# EAGLE design Color-lcd-backpack-v1 (EAGLE 5.06)
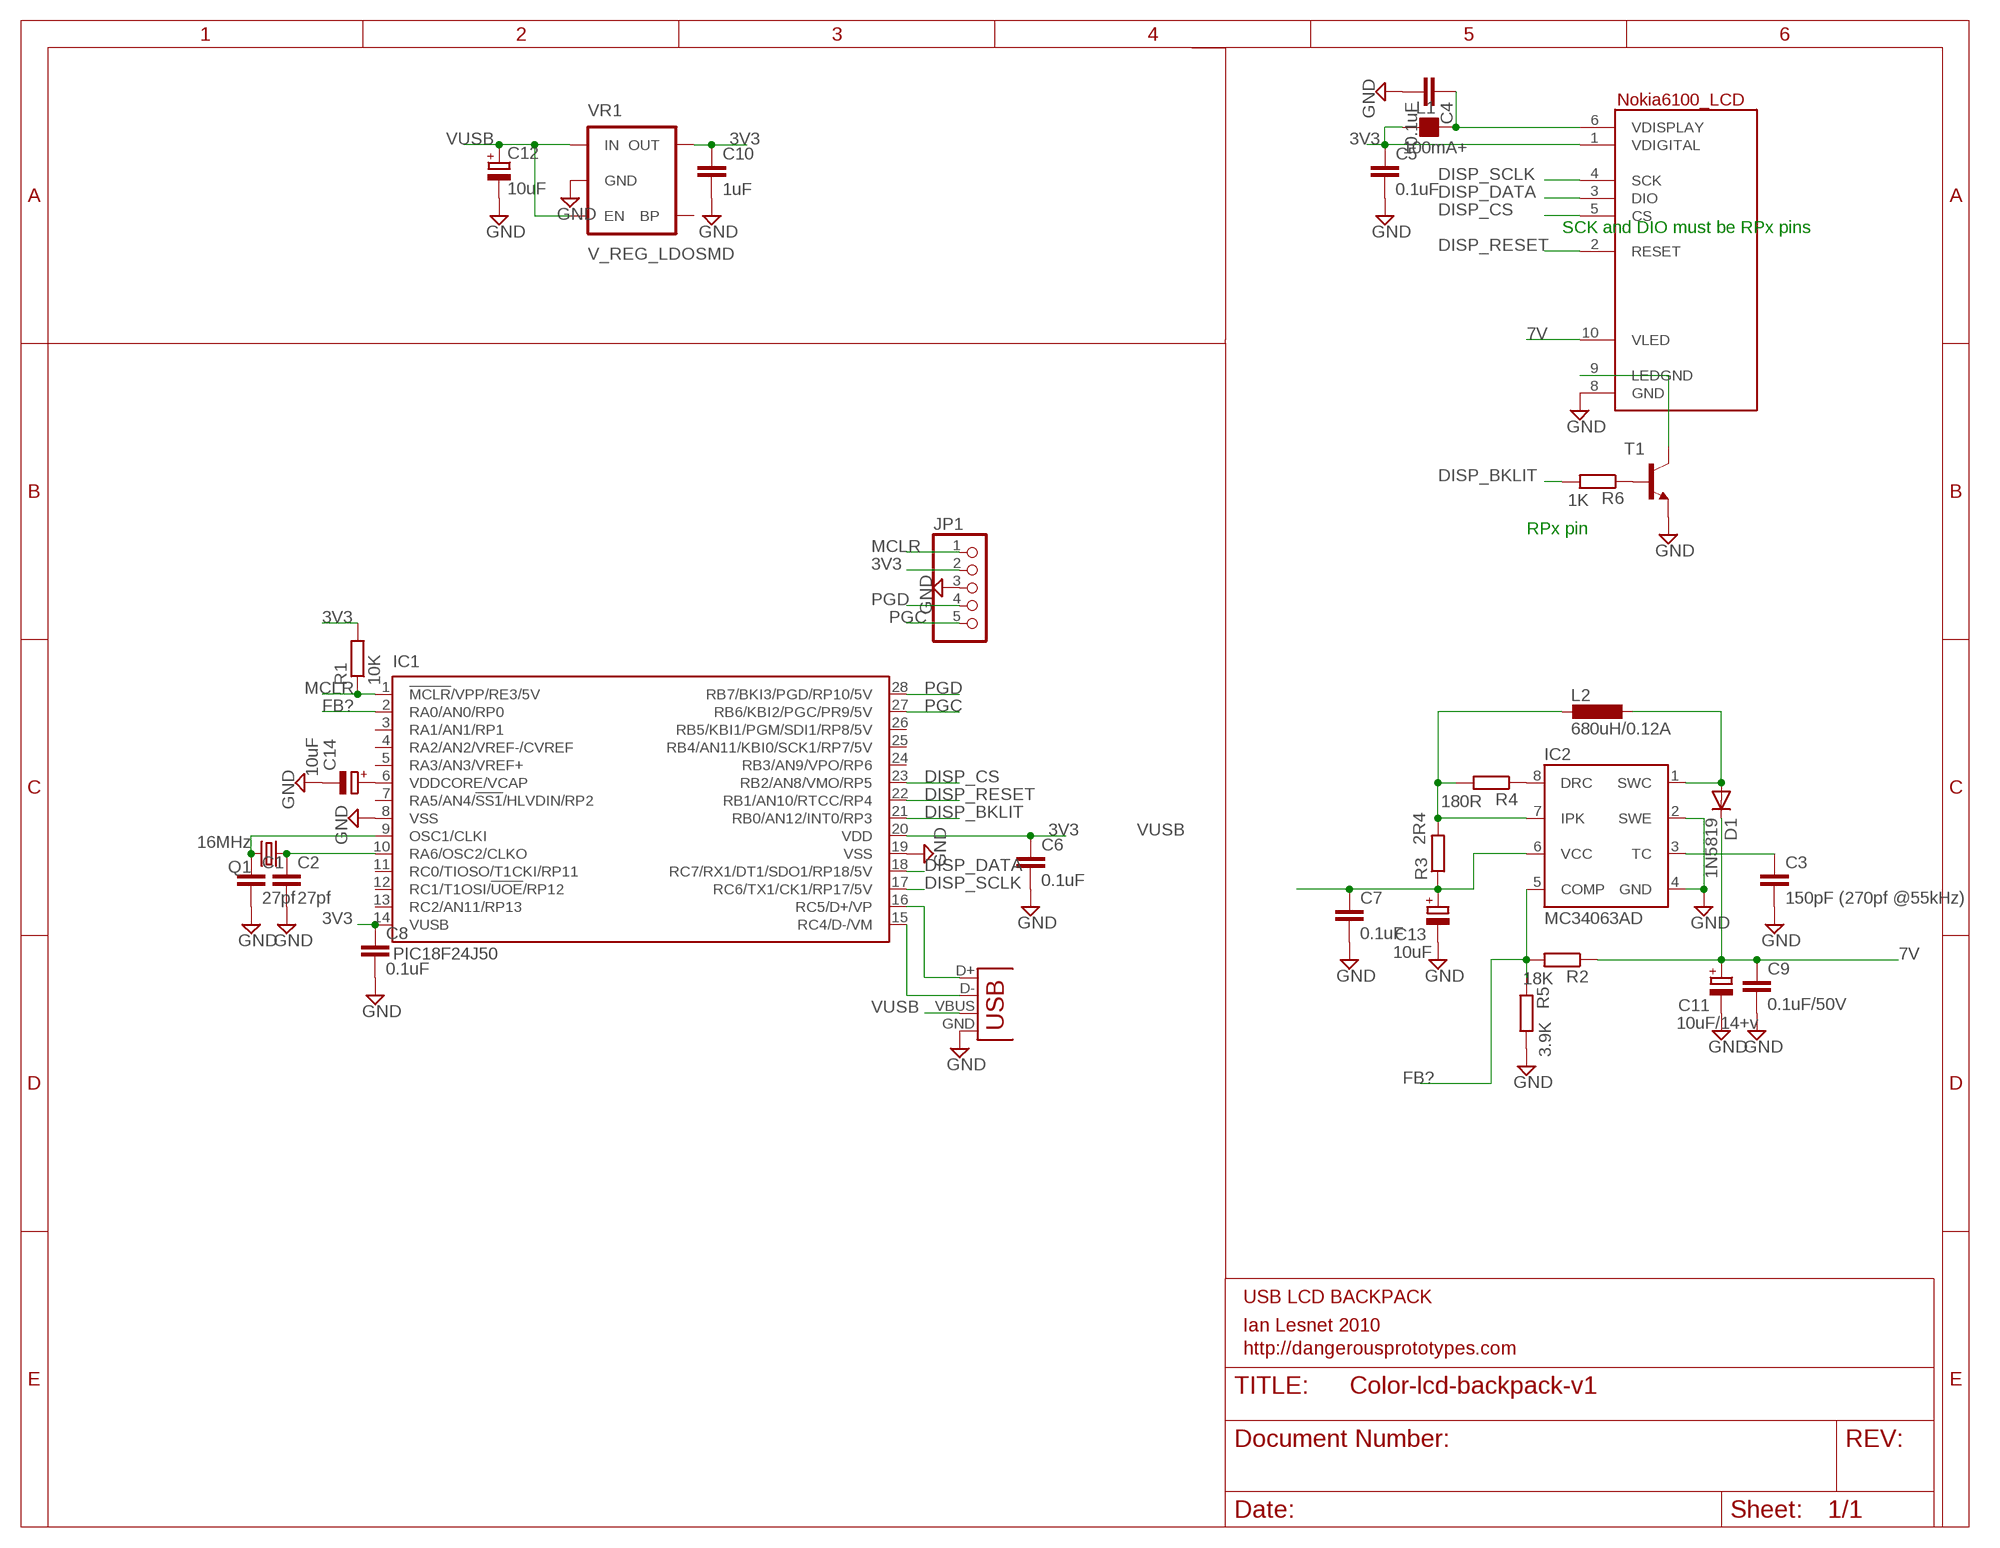
[diagram p0: schematic, sheet 1]

## Parts
C1  27pf  C-EUC0805  [C0805]
C2  27pf  C-EUC0805  [C0805]
C3  150pF (270pf @55kHz)  C-EUC0805K  [C0805K]
C4  0.1uF  C-EUC0805  [C0805]
C5  0.1uF  C-EUC0805  [C0805]
C6  0.1uF  C-EUC0805  [C0805]
C7  0.1uF  C-EUC0805K  [C0805K]
C8  0.1uF  C-EUC0805  [C0805]
C9  0.1uF/50V  C-EUC0805K  [C0805K]
C10  1uF  C-EUC0805  [C0805]
C11  10uF/14+v  CPOL-EUSANYO_SMD_A5  [SANYO-OSCON_SMD_A5]
C12  10uF  CPOL-EUSMCA  [SMC_A]
C13  10uF  CPOL-EUSMCA  [SMC_A]
C14  10uF  CPOL-EUSMCA  [SMC_A]
D1  1N5819  MBR0520LT  [SOD123]
IC1  PIC18F24J50  PIC18FJ2X50SSOP  [SSOP28]
IC2  MC34063AD  [SO08]
J1  USBSMD  [USB-MINIB]
JP1  PINHD-1X5  [1X05]
L1  100mA+  FB_0805  [L0805]
L2  680uH/0.12A  L-EUL4532P  [L4532P]
LCD1  NOKIA6100_LCD  [NOKIA6100_LCD]
Q1  16MHz  CRYSTALHC49UP  [HC49UP]
R1  10K  R-EU_M0805  [M0805]
R2  18K  R-EU_M0805  [M0805]
R3  2R4  R-EU_M0805  [M0805]
R4  180R  R-EU_M0805  [M0805]
R5  3.9K  R-EU_M0805  [M0805]
R6  1K  R-EU_M0805  [M0805]
T1  NPNSOT23BEC  [SOT23-BEC]
VR1  V_REG_LDOSMD  [SOT23-5]

## Nets
3V3: C5.1 C6.1 C8.1 C10.1 IC1.14(VUSB) IC1.20(VDD) JP1.2 L1.1 LCD1.1(VDIGITAL) R1.2 VR1.5(OUT)
7V: C9.1 C11.+ D1.C LCD1.10(VLED) R2.1
DISP_BKLIT: IC1.21(RB0/AN12/INT0/RP3) R6.2
DISP_CS: IC1.23(RB2/AN8/VMO/RP5) LCD1.5(CS)
DISP_DATA: IC1.18(RC7/RX1/DT1/SDO1/RP18/5V) LCD1.3(DIO)
DISP_RESET: IC1.22(RB1/AN10/RTCC/RP4) LCD1.2(RESET)
DISP_SCLK: IC1.17(RC6/TX1/CK1/RP17/5V) LCD1.4(SCK)
FB?: IC1.2(RA0/AN0/RP0) IC2.5(COMP) R2.2 R5.1
GND: C1.2 C2.2 C3.2 C4.2 C5.2 C6.2 C7.2 C8.2 C9.2 C10.2 C11.- C12.- C13.- C14.- IC1.8(VSS) IC1.19(VSS) IC2.2(SWE) IC2.4(GND) J1.GND JP1.3 LCD1.8(GND) R5.2 T1.E VR1.2(GND)
MCLR: IC1.1(!MCLR!/VPP/RE3/5V) JP1.1 R1.1
N$1: LCD1.9(LEDGND) T1.C
N$2: C4.1 L1.2 LCD1.6(VDISPLAY)
N$3: R6.1 T1.B
N$4: C1.1 IC1.9(OSC1/CLKI) Q1.2
N$5: C2.1 IC1.10(RA6/OSC2/CLKO) Q1.1
N$6: C14.+ IC1.6(VDDCORE/VCAP)
N$7: IC1.16(RC5/D+/VP) J1.D+
N$8: IC1.15(RC4/D-/VM) J1.D-
N$9: IC2.8(DRC) R4.1
N$11: IC2.7(IPK) L2.2 R3.2 R4.2
N$17: D1.A IC2.1(SWC) L2.1
N$19: C3.1 IC2.3(TC)
PGC: IC1.27(RB6/KBI2/PGC/PR9/5V) JP1.5
PGD: IC1.28(RB7/BKI3/PGD/RP10/5V) JP1.4
VUSB: C7.1 C12.+ C13.+ IC2.6(VCC) J1.VBUS R3.1 VR1.1(IN) VR1.3(EN)
Unconnected: IC1.3(RA1/AN1/RP1) IC1.4(RA2/AN2/VREF-/CVREF) IC1.5(RA3/AN3/VREF+) IC1.7(RA5/AN4/!SS1!/HLVDIN/RP2) IC1.11(RC0/TIOSO/T1CKI/RP11) IC1.12(RC1/T1OSI/!UOE!/RP12) IC1.13(RC2/AN11/RP13) IC1.24(RB3/AN9/VPO/RP6) IC1.25(RB4/AN11/KBI0/SCK1/RP7/5V) IC1.26(RB5/KBI1/PGM/SDI1/RP8/5V) VR1.4(BP)

## Notes on the sheet
- SCK and DIO must be RPx pins
- RPx pin
- USB LCD BACKPACK
- Ian Lesnet 2010
- http://dangerousprototypes.com

## Library data of the parts
C1 C2 C4-C6 C8 C10 = resistor:C-EU: CAPACITOR, European symbol
C3 C7 C9 = rcl:C-EU: CAPACITOR, European symbol
C11-C14 = rcl:CPOL-EU: POLARIZED CAPACITOR, European symbol
D1 = diode:MBR0520LT: SCHOTTKY BARRIER RECTIFIER Source: http://onsemi.com .. MBR0520LT1-D.pdf
IC1 = dp_devices:PIC18FJ2X50; PIC18FJ2X50: PIC18FJ2X50
IC2 = v-reg-3:MC34063A: 1.5A Step-Up/Down/Inverting Switching Regulator NPN Darlington Switch, Vin 3V to 40V, Current Limiter Input, adjustable Frequency up to 100kHz
J1 = SparkFun:USB: USB Connectors USB-B-PTH is fully proven SKU : PRT-00139 USB-miniB is fully proven SKU : PRT-00587 USB-A-PCB is untested. USB-A-H is throughly reviewed, but untested. Spark Fun Electronics SKU : PRT-00437 USB-B-SMT is throughly reviewed, but untested. Needs silkscreen touching up. USB-A-S has not been used/tested USB-MB-H has not been used/tested
JP1 = pinhead-2:PINHD-1X5: PIN HEADER
L1 = rc-master:FB_: FERRITE BEAD
L2 = rcl:L-EU: INDUCTOR, European symbol
LCD1 = SparkFun:NOKIA6100_LCD: Nokia 6100 Color LCD Schematic element and footprint production proven but could use some touching up. Spark Fun Electronics SKU : LCD-00569. Mating SMD connector : LCD-00570
Q1 = crystal:CRYSTAL: CRYSTAL
R1 = resistor:R-EU_: RESISTOR, European symbol
R2-R6 = rcl:R-EU_: RESISTOR, European symbol
T1 = dp_devices:NPN: Most commonly used is SOT23-BEC
VR1 = SparkFun:V_REG_LDO: Voltage Regulator LDO Standard 150mA LDO voltage regulator in SOT-23 layout. Micrel part MIC5205. BP (by-pass) pin is used to lower output noise with 470pF cap.

## Board
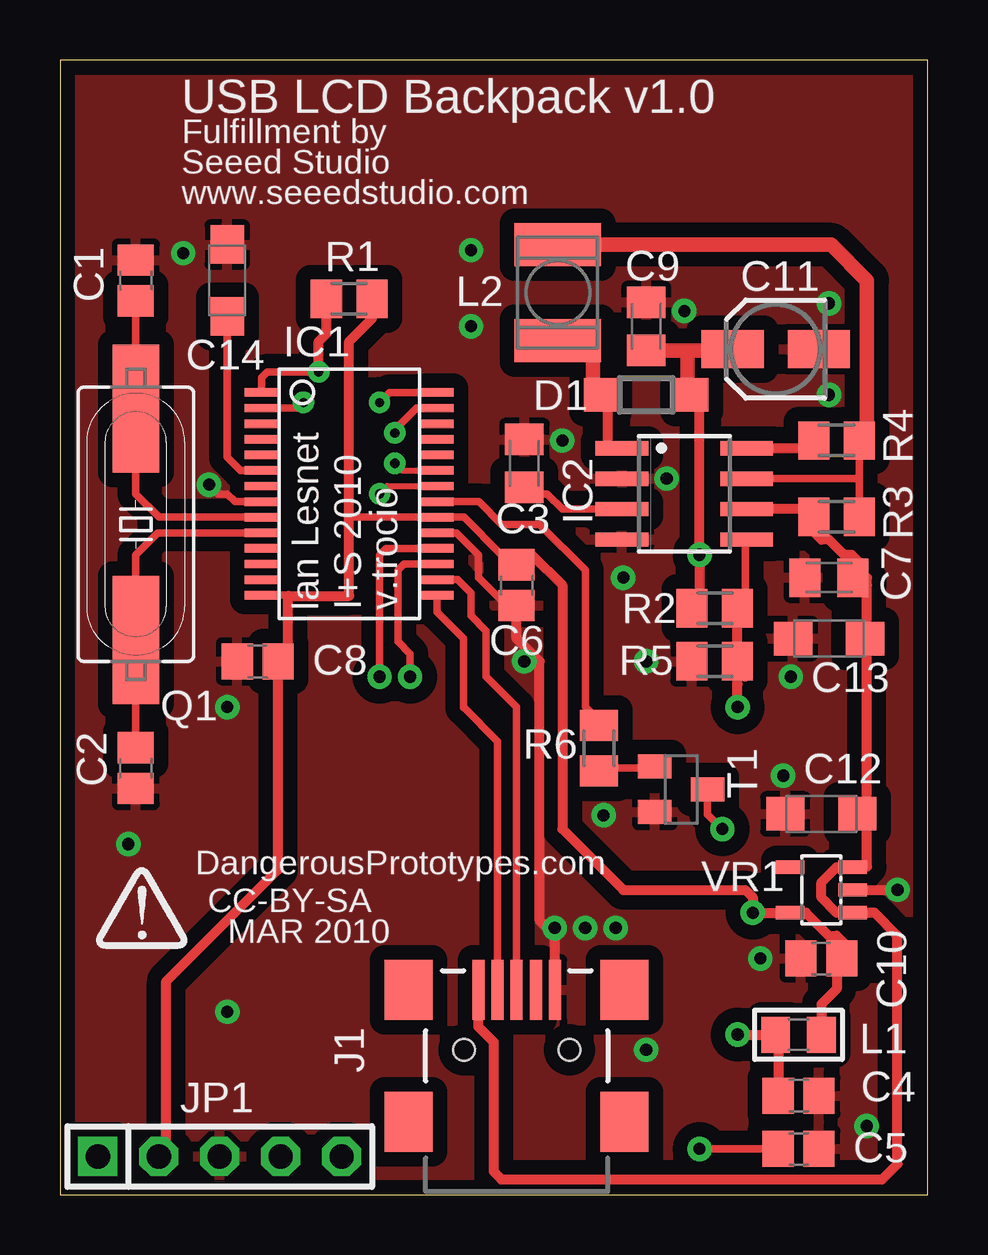
[diagram p1: board, top side]
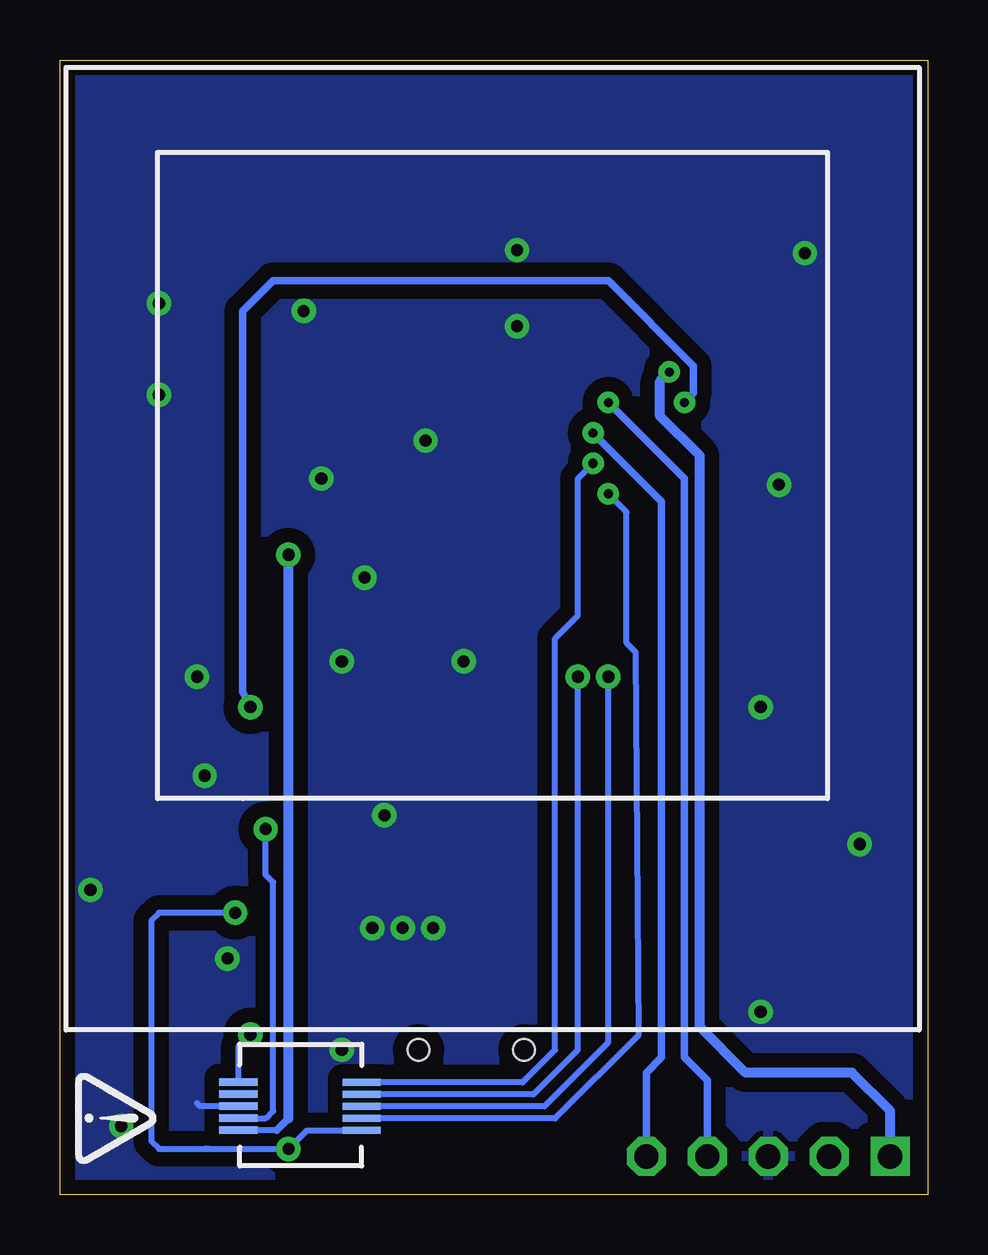
[diagram p2: board, bottom side, seen from below]

Size 36.18 x 47.3 mm. Coordinates in mm from the lower left corner, seen from the top.
Outline: 36.18,0 36.18,47.3 0,47.3 0,0 36.18,0
Copper layers (1*16): Top 0.035mm / dielectric 1.5mm / Bottom 0.035mm
Design rules "SparkFun": minimum track width 8mil, minimum drill 20mil, track to track 8mil, track to pad 8mil, pad to pad 8mil, via to via 8mil, smd to smd 8mil, copper to edge 10mil, drill to drill 8mil, minimum pad ring 12mil, minimum via ring 10mil, stop-mask expansion 4mil, vias tented up to drill 25mil, thermal gap 10mil

### Footprints (pad centres in the part's own frame; a part is rotated, then mirrored left to right if it is on the bottom)
C0805 = smd 1.3 x 1.5: 1 -0.85,0; 2 0.85,0
C0805K = smd 1.3 x 1.6: 1 -1,0; 2 1,0
SANYO-OSCON_SMD_A5 = smd 2.6 x 1.6: + 1.8,0; - -1.8,0
SMC_A = smd 1.6 x 1.4: + -1.5,0; - 1.5,0
SOD123 = smd 1.4 x 1.4: A 1.9,0; C -1.9,0
SSOP28 = smd 0.348 x 1.397: 1 -4.225,-3.656; 2 -3.575,-3.656; 3 -2.925,-3.656; 4 -2.275,-3.656; 5 -1.625,-3.656; 6 -0.975,-3.656; 7 -0.325,-3.656; 8 0.325,-3.656; 9 0.975,-3.656; 10 1.625,-3.656; 11 2.275,-3.656; 12 2.925,-3.656; 13 3.575,-3.656; 14 4.225,-3.656; 15 4.225,3.656; 16 3.575,3.656; 17 2.925,3.656; 18 2.275,3.656; 19 1.625,3.656; 20 0.975,3.656; 21 0.325,3.656; 22 -0.325,3.656; 23 -0.975,3.656; 24 -1.625,3.656; 25 -2.275,3.656; 26 -2.925,3.656; 27 -3.575,3.656; 28 -4.225,3.656
SO08 = smd 0.6 x 2.2: 1 -1.905,-2.6; 2 -0.635,-2.6; 3 0.635,-2.6; 4 1.905,-2.6; 5 1.905,2.6; 6 0.635,2.6; 7 -0.635,2.6; 8 -1.905,2.6
USB-MINIB = smd 2.5 x 0.5: D+ 2.5,0; D- 2.5,0.8; GND 2.5,-1.6; ID 2.5,-0.8; VBUS 2.5,1.6 | smd 2.5 x 2: GND@1 -3,-4.5; GND@2 -3,4.5; GND@3 2.5,4.5; GND@4 2.5,-4.5 | hole 0.9: 0,2.2; 0,-2.2
1X05 = drill 1.016 square: 1 -5.08,0 | drill 1.016 octagon: 2 -2.54,0; 3 0,0; 4 2.54,0; 5 5.08,0
L0805 = smd 1.2 x 1.5: 1 -0.953,0; 2 0.953,0
L4532P = smd 1.8 x 3.6: 1 -2,0; 2 2,0
NOKIA6100_LCD = smd 1.6 x 0.3: 1 24.255,44.311; 2 24.255,43.811; 3 24.255,43.311; 4 24.255,42.811; 5 24.255,42.311; 6 29.389,42.303; 7 29.389,42.803; 8 29.389,43.303; 9 29.389,43.803; 10 29.389,44.303
HC49UP = smd 5.334 x 1.93: 1 -4.826,0; 2 4.826,0
M0805 = smd 1.3 x 1.6: 1 -0.95,0; 2 0.95,0
SOT23-BEC = smd 1 x 1.4: B -0.95,-1.1; C 0,1.1; E 0.95,-1.1
SOT23-5 = smd 0.55 x 1.2: 1 -0.95,-1.3; 2 0,-1.3; 3 0.95,-1.3; 4 0.95,1.3; 5 -0.95,1.3

### Placement (x,y rotation side)
C1  3.17,38.1 90 top
C2  3.17,17.78 270 top
C3  19.36,30.48 90 top
C4  30.79,4.13 0 top
C5  30.79,1.91 0 top
C6  19.04,25.4 270 top
C7  32.06,25.72 180 top
C8  8.25,22.23 180 top
C9  24.44,36.2 90 top
C10  31.74,9.84 180 top
C11  29.84,35.24 180 top
C12  31.74,15.88 180 top
C13  32.06,23.18 180 top
C14  6.97,38.1 90 top
D1  24.44,33.34 180 top
IC1  12.05,29.21 270 top
IC2  26.03,29.21 270 top
J1  19.04,6.03 90 top
JP1  6.66,1.59 0 top
L1  30.79,6.67 180 top
L2  20.75,37.59 90 top
LCD1  -0.65,46.99 180 bottom
Q1  3.17,27.94 90 top
R1  12.05,37.34 0 top
R2  27.3,24.45 0 top
R3  32.38,28.26 0 top
R4  32.38,31.43 0 top
R5  27.3,22.23 180 top
R6  22.47,18.61 90 top
T1  25.9,16.89 270 top
U$1  [DP-LOGO_TOP]  1.5,10.25 0 top
U$2  [DP-LOGO-BOTTOM]  35.55,1.27 90 top
VR1  31.74,12.7 90 top

### Tracks (layer width: path | path; a pad name or v marks a point on that pad's centre or on a via)
3V3  (via drill 0.51)
  Top 0.305: 19.04,26.67 C6.1 | v26.66,1.91 C5.1 | 18.72,26.67 18.41,26.67 16.84,28.23 IC1.20 12.07,28.23 12.05,28.25 | IC1.14 9.49,24.98 9.52,24.96
  Top 0.406: 18.72,26.67 19.04,26.35 19.04,26.67 19.68,26.67 20.95,25.4 20.95,15.24 23.48,12.7 28.57,12.7 28.88,12.38 v28.88,11.75 v28.89,11.75 VR1.5 31.1,11.75 32.06,10.79 32.38,10.79 32.69,10.48 32.69,9.95 C10.1 | JP1.2 4.44,1.91 4.44,8.89 9.1,13.55 C8.1 9.52,22.86 9.52,24.96 12.05,24.96 12.05,28.25 12.05,35.56 13.01,36.51 R1.2 | C10.1 32.38,10.06 | C10.1 32.38,9.84 32.38,8.57 31.74,7.94 L1.1
  Bottom 0.254: LCD1.1 25.89,2.68 v26.66,1.91 C5.1 | C5.1 30.15,1.91 | v28.88,11.75 32.06,11.75 32.38,11.43 32.38,2.22 32.06,1.91 C5.1
7V  (via drill 0.51)
  Top 0.305: 26.66,24.45 R2.1 26.66,24.45
  Top 0.406: 26.66,24.45 | R2.1 26.66,24.76 v26.66,26.67 26.66,33.29 26.61,33.34 | 26.61,33.34 D1.C | 24.48,35.18 C9.1 | 26.61,33.34 26.15,33.38 | C11.+ 27.93,35.24 27.61,35.18
  Top 0.61: 26.15,35.18 24.48,35.18 | 26.15,33.38 26.15,35.18 | 26.15,35.18 27.61,35.18
  Bottom 0.254: 27.15,2.69 LCD1.10
  Bottom 0.305: 26.66,3.17 27.15,2.69
  Bottom 0.406: 26.66,3.17 v26.66,26.67
DISP_BKLIT
  Top 0.305: R6.2 22.53,19.68 21.9,20.32 21.9,26.04 19.99,27.94 18.41,27.94 17.46,28.89 IC1.21
DISP_CS  (via drill 0.38)
  Top 0.254: IC1.23 14.26,30.18 v13.96,30.48
  Bottom 0.254: LCD1.5 16.9,4.68 15.55,6.03 15.55,23.18 14.6,24.13 14.6,29.84 v13.96,30.48
DISP_DATA  (via drill 0.51)
  Top 0.305: IC1.18 13.59,26.93 13.33,26.67 v13.33,21.59
  Bottom 0.254: LCD1.3 16,3.68 13.33,6.35 v13.33,21.59
DISP_RESET  (via drill 0.38)
  Top 0.254: IC1.22 13.65,29.54 v13.33,29.21
  Bottom 0.254: LCD1.2 15.55,3.17 12.05,6.67 12.18,22.61 12.56,22.99 12.56,28.45 v13.33,29.21
DISP_SCLK  (via drill 0.51)
  Top 0.305: v14.6,21.59 14.6,22.54 14.09,23.05 14.09,26.04 14.34,26.29 IC1.17
  Bottom 0.254: LCD1.4 16.45,4.18 14.6,6.03 v14.6,21.59
FB?  (via drill 0.38, 0.51)
  Top 0.305: IC2.5 28.57,27.3 28.57,24.76 R2.2 28.57,24.45 | IC1.2 9.92,32.78 v10.15,33.02
  Top 0.406: R5.1 28.25,21.91 28.57,21.59 | R5.1 R2.2 | R5.1 28.25,21.27 v28.25,20.32
  Bottom 0.305: v10.15,33.02 9.77,33.4 9.77,34.54 13.33,38.1 27.3,38.1 28.57,36.83 28.57,20.95 v28.25,20.32
GND  (via drill 0.51)
  Top 0.305: IC1.19 16.54,27.59 17.45,26.67 17.45,25.72 18.41,24.77 18.82,24.77 C6.2 | 18.94,24.45 18.94,24.66 19.04,24.77 | IC1.8 7.3,28.89 6.97,29.21 6.59,29.21 v6.21,29.59
  Top 0.406: 18.94,24.45 C6.2 19.04,23.18 19.99,22.23 19.99,11.43 20.64,10.78 J1.GND | VR1.2 v34.91,12.7
  Bottom 0.254: LCD1.8 30.35,3.69 30.47,3.81
  other vias: 17.14,39.37 6.97,7.62 19.36,22.23 20.95,31.43 23.48,25.72 30.47,21.59 25.29,29.84 2.85,14.61 5.13,39.24 20.63,11.11 24.44,6.03 29.2,9.84 33.63,2.86 24.44,22.23 22.66,15.81 30.15,17.46 21.9,11.11 23.17,11.11 6.97,20.32 26.03,36.83 32.06,33.34 32.06,37.15 17.14,36.2
  pour Top (isolate 0.61): -0.01,0 -0.01,47.31 36.18,47.31 36.18,0
  pour Bottom (isolate 0.61): -0.01,0 -0.01,47.31 36.18,47.31 36.18,0
MCLR  (via drill 0.38)
  Top 0.305: IC1.1 8.4,34.06 8.63,34.29 v10.79,34.29
  Top 0.406: v10.79,34.29 10.79,35.56 11.11,35.88 R1.1
  Bottom 0.406: v10.79,34.29 11.17,33.91 11.17,32.45 9.52,30.8 9.52,6.99 7.61,5.08 3.17,5.08 1.58,3.49 JP1.1
N$1  (via drill 0.51)
  Top 0.305: T1.C 27,15.85 v27.61,15.24
  Bottom 0.254: LCD1.9 27.6,3.19 27.3,3.49 27.3,13.02 27.61,13.34 v27.61,15.24
N$2  (via drill 0.51)
  Top 0.406: C4.1 29.94,6.25 L1.2 v28.25,6.67
  Bottom 0.254: LCD1.6 28.74,6.17 v28.25,6.67
N$3
  Top 0.305: T1.B 24.75,17.84 24.75,17.78 22.47,17.78 R6.1
N$4
  Top 0.305: C1.1 Q1.2 3.17,29.21 4.14,28.23 IC1.9
N$5
  Top 0.305: C2.1 Q1.1 3.17,26.67 4.08,27.59 IC1.10
N$6
  Top 0.305: C14.+ 6.97,30.73 7.52,30.18 IC1.6
N$7
  Top 0.305: J1.D+ 19.04,20.32 17.77,21.59 17.77,23.5 17.14,24.13 17.14,25.08 16.58,25.64 IC1.16
N$8
  Top 0.305: J1.D- 18.24,18.9 16.82,20.32 | 16.82,20.32 16.82,20.3 | IC1.15 15.71,24.28 16.82,23.18 16.82,20.32
N$9
  Top 0.406: IC2.8 31.42,31.11 R4.1
N$11
  Top 0.305: IC2.7 33.33,29.84 | 33.33,29.84 R3.2 | R4.2 33.33,29.84
  Top 0.61: L2.2 32.15,39.59 33.64,38.1 33.64,31.75 R4.2
N$17
  Top 0.406: IC2.1 22.85,31.11 22.85,33.02 D1.A 22.85,33.65
  Top 0.61: L2.1 22.18,35.59 22.21,35.56 22.21,33.66 D1.A
N$19
  Top 0.305: IC2.3 20.95,28.57 20.31,29.21 19.63,29.21 C3.1
PGC  (via drill 0.38)
  Top 0.305: IC1.27 14.87,32.78 14.09,32 13.96,31.88 v13.96,31.75
  Bottom 0.305: JP1.5 11.74,5.08 11.1,5.71 11.1,28.89 v13.96,31.75
PGD  (via drill 0.38)
  Top 0.305: IC1.28 13.74,33.44 v13.33,33.02
  Bottom 0.305: JP1.4 9.2,4.76 10.15,5.71 10.15,29.84 v13.33,33.02
VUSB
  Top 0.305: R3.1 | C7.1 33.64,25.4
  Top 0.406: IC2.6 31.42,28.57 R3.1 31.11,28.26 31.11,27.94 31.42,27.94 31.42,27.62 31.74,27.3 32.06,27.3 32.69,26.67 33.01,26.67 33.33,26.35 33.28,26.35 33.01,26.08 C7.1 33.64,25.72 33.64,23.41 C13.+ 33.64,23.18 33.64,16.11 C12.+ 33.64,15.88 33.64,13.68 VR1.3 32.38,13.65 31.74,13.02 31.74,12.38 32.37,11.75 VR1.1 | 33.64,25.4 33.41,25.4 | J1.VBUS 17.44,7 18.09,6.35 18.09,0.95 18.41,0.64 34.28,0.64 34.91,1.27 34.91,10.79 33.96,11.75 VR1.1 | VR1.1 33.68,11.75

### Text on the board
tPlace: v.trocio
tNames: USB LCD Backpack v1.0 | Fulfillment by | Seeed Studio | www.seeedstudio.com | Ian Lesnet | I+S 2010 | DangerousPrototypes.com | CC-BY-SA | MAR 2010